# EAGLE design ThoraxSensor3.0 (EAGLE 9.6.2)
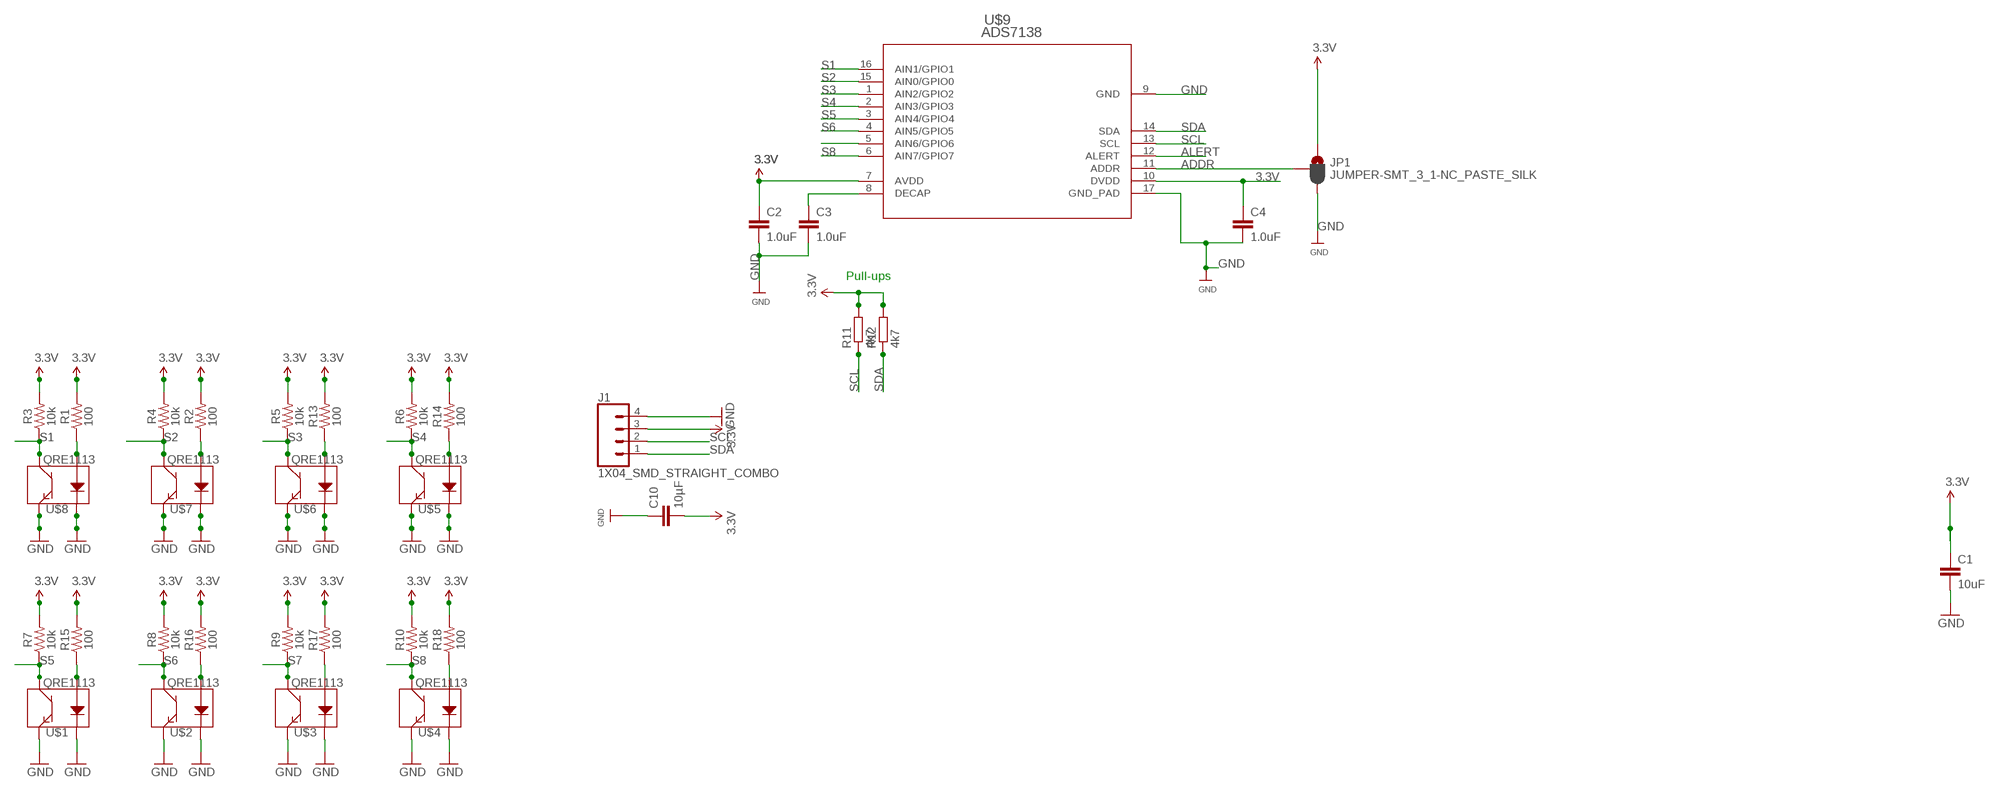
[diagram p0: schematic, sheet 1]

## Parts
C1  10uF  10UF-0805-10V-10%  [0805]
C2  1.0uF  1.0UF-0603-16V-10%  [0603]
C3  1.0uF  1.0UF-0603-16V-10%  [0603]
C4  1.0uF  1.0UF-0603-16V-10%  [0603]
C10  10µF  C-EUC0805  [C0805]
J1  1X04_SMD_STRAIGHT_COMBO  CONN_04SMD_STRAIGHT_COMBO  [1X04_SMD_VERTICAL_COMBO]
JP1  JUMPER-SMT_3_1-NC_PASTE_SILK  [SMT-JUMPER_3_1-NC_PASTE_SILK]
R1  100  100OHM-0603-1/4W-5%  [0603]
R2  100  100OHM-0603-1/4W-5%  [0603]
R3  10k  10KOHM-0603-1/10W-1%  [0603]
R4  10k  10KOHM-0603-1/10W-1%  [0603]
R5  10k  10KOHM-0603-1/10W-1%  [0603]
R6  10k  10KOHM-0603-1/10W-1%  [0603]
R7  10k  10KOHM-0603-1/10W-1%  [0603]
R8  10k  10KOHM-0603-1/10W-1%  [0603]
R9  10k  10KOHM-0603-1/10W-1%  [0603]
R10  10k  10KOHM-0603-1/10W-1%  [0603]
R11  4k7  R-EU_R0603  [R0603]
R12  4k7  R-EU_R0603  [R0603]
R13  100  100OHM-0603-1/4W-5%  [0603]
R14  100  100OHM-0603-1/4W-5%  [0603]
R15  100  100OHM-0603-1/4W-5%  [0603]
R16  100  100OHM-0603-1/4W-5%  [0603]
R17  100  100OHM-0603-1/4W-5%  [0603]
R18  100  100OHM-0603-1/4W-5%  [0603]
U$1  QRE1113  [QRE1113]
U$2  QRE1113  [QRE1113]
U$3  QRE1113  [QRE1113]
U$4  QRE1113  [QRE1113]
U$5  QRE1113  [QRE1113]
U$6  QRE1113  [QRE1113]
U$7  QRE1113  [QRE1113]
U$8  QRE1113  [QRE1113]
U$9  ADS7138  [QFN_8IRTER_TEX]

## Nets
3.3V [pwr]: C1.1 C2.1 C4.1 C10.2 J1.3 JP1.1 R1.2 R2.2 R3.2 R4.2 R5.2 R6.2 R7.2 R8.2 R9.2 R10.2 R11.2 R12.2 R13.2 R14.2 R15.2 R16.2 R17.2 R18.2 U$9.7(AVDD) U$9.10(DVDD)
ADDR: JP1.2 U$9.11(ADDR)
ALERT: U$9.12(ALERT)
GND [pwr]: C1.2 C2.2 C3.2 C4.2 C10.1 J1.4 JP1.3 U$1.2(K) U$1.4(E) U$2.2(K) U$2.4(E) U$3.2(K) U$3.4(E) U$4.2(K) U$4.4(E) U$5.2(K) U$5.4(E) U$6.2(K) U$6.4(E) U$7.2(K) U$7.4(E) U$8.2(K) U$8.4(E) U$9.9(GND) U$9.17(GND_PAD)
N$1: R1.1 U$8.1(A)
N$2: R2.1 U$7.1(A)
N$3: R13.1 U$6.1(A)
N$4: R14.1 U$5.1(A)
N$5: R15.1 U$1.1(A)
N$6: R16.1 U$2.1(A)
N$7: R17.1 U$3.1(A)
N$8: R18.1 U$4.1(A)
N$13: C3.1 U$9.8(DECAP)
S1: R3.1 U$8.3(C) U$9.16(AIN1/GPIO1)
S2: R4.1 U$7.3(C) U$9.15(AIN0/GPIO0)
S3: R5.1 U$6.3(C) U$9.1(AIN2/GPIO2)
S4: R6.1 U$5.3(C) U$9.2(AIN3/GPIO3)
S5: R7.1 U$1.3(C) U$9.3(AIN4/GPIO4)
S6: R8.1 U$2.3(C) U$9.4(AIN5/GPIO5)
S7: R9.1 U$3.3(C) U$9.5(AIN6/GPIO6)
S8: R10.1 U$4.3(C) U$9.6(AIN7/GPIO7)
SCL: J1.2 R11.1 U$9.13(SCL)
SDA: J1.1 R12.1 U$9.14(SDA)

## Notes on the sheet
- Pull-ups

## Library data of the parts
C1 = SparkFun-Capacitors:10UF: 10.0µF ceramic capacitors A capacitor is a passive two-terminal electrical component used to store electrical energy temporarily in an electric field.; PROD_ID: CAP-11330
C2-C4 = SparkFun-Capacitors:1.0UF: 1µF ceramic capacitors A capacitor is a passive two-terminal electrical component used to store electrical energy temporarily in an electric field.; PROD_ID: CAP-00868
C10 = rcl:C-EU: CAPACITOR, European symbol; SPICEPREFIX: C
J1 = SparkFun-Connectors:CONN_04: Multi connection point. Often used as Generic Header-pin footprint for 0.1 inch spaced/style header connections On any of the 0.1 inch spaced packages, you can populate with these: Break Away Headers - Straight <https://www.sparkfun.com/products/116> (PRT-00116) Break Away Male Headers - Right Angle <https://www.sparkfun.com/products/553> (PRT-00553) Female Headers <https://www.sparkfun.com/products/115> (PRT-00115) Break Away Headers - Machine Pin <https://www.sparkfun.com/products/117> (PRT-00117) Break Away Female Headers - Swiss Machine Pin <https://www.sparkfun.com/products/743> (PRT-00743) For SCREWTERMINALS and SPRING TERMINALS visit here: Screw Terimnals on SparkFun.com <https://www.sparkfun.com/search/results?term=Screw+Terminals> (5mm/3.5mm/2.54mm spacing) This device is also useful as a general connection point to wire up your design to another part of your project. Our various solder wires solder well into these plated through hole pads. Hook-Up Wire - Assortment (Stranded, 22 AWG) <https://www.sparkfun.com/products/11375> (PRT-11375) Hook-Up Wire - Assortment (Solid Core, 22 AWG) <https://www.sparkfun.com/products/11367> (PRT-11367) View the entire wire category on our website here <https://www.sparkfun.com/categories/141> Special notes: Molex polarized connector foot print use with SKU : PRT-08231 with associated crimp pins and housings. 1MM SMD Version SKU: PRT-10208; PROD_ID: CONN-08511
JP1 = SparkFun-Jumpers:JUMPER-SMT_3_1-NC_PASTE: Normally closed solder jumper (1 of 2 connections) This jumper has an aperture in the stencil to allow solder paste to bridge one of the two connections. One connection is normally closed (NC), while the other is normally open (NO). Wick off the solder to open the connection. Reapply solder to reclose the connection. Apply solder to the other side instead to change the current path.
R1 R2 R13-R18 = SparkFun-Resistors:100OHM: 100Ω resistor A resistor is a passive two-terminal electrical component that implements electrical resistance as a circuit element. Resistors act to reduce current flow, and, at the same time, act to lower voltage levels within circuits. - Wikipedia; PROD_ID: RES-12438
R3-R10 = SparkFun-Resistors:10KOHM: 10kΩ resistor A resistor is a passive two-terminal electrical component that implements electrical resistance as a circuit element. Resistors act to reduce current flow, and, at the same time, act to lower voltage levels within circuits. - Wikipedia; PROD_ID: RES-00824
R11 R12 = rcl:R-EU_: RESISTOR, European symbol; SPICEPREFIX: R
U$1-U$8 = SparkFun:QRE1113
U$9 = ADS7138:ADS7138

## Net classes
1 pwr: width 0.254 mm

## Board
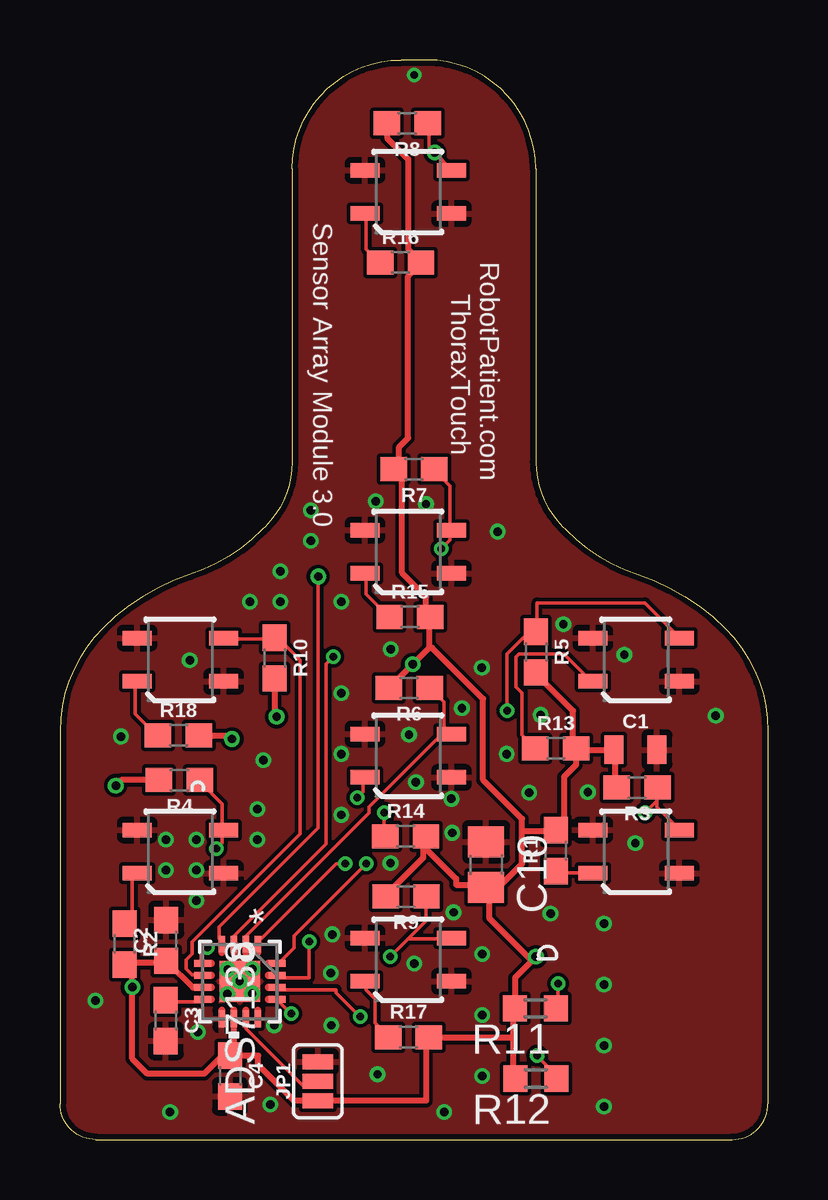
[diagram p1: board, top side]
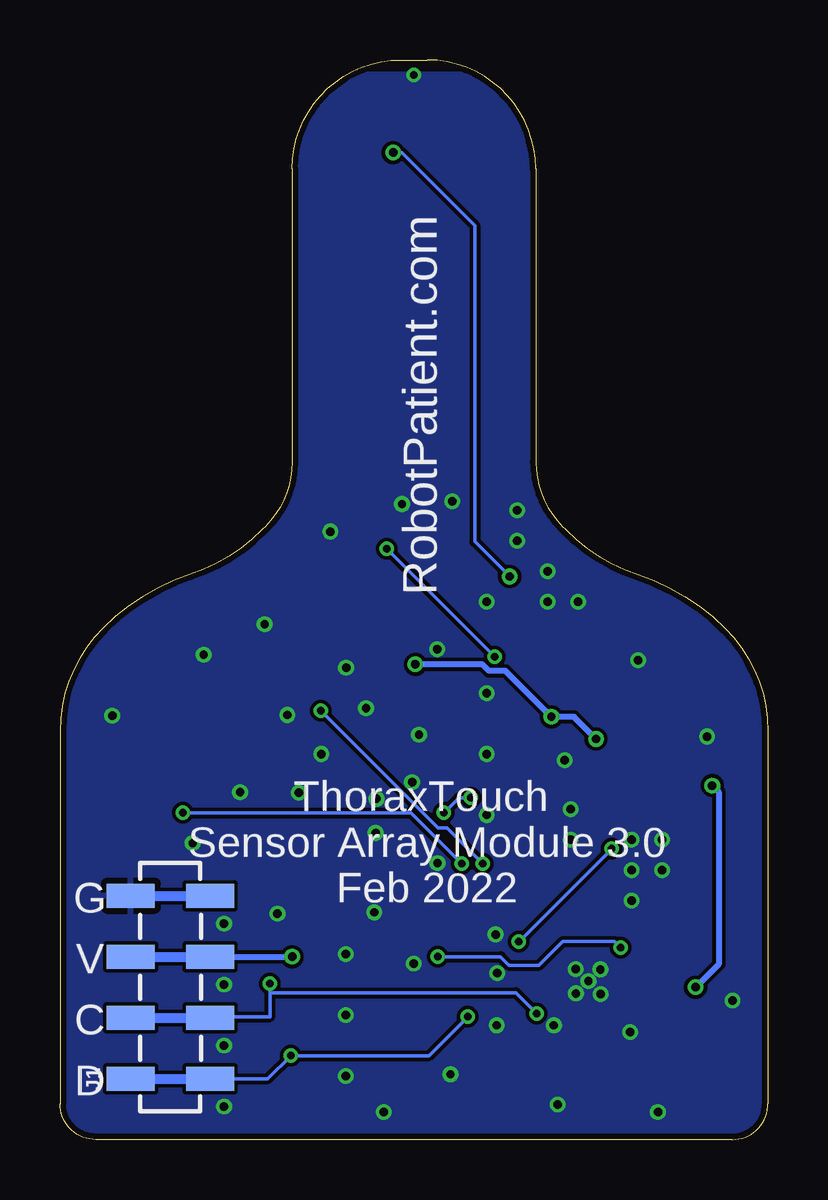
[diagram p2: board, bottom side, seen from below]

Size 29.52 x 45 mm. Coordinates in mm from the lower left corner, seen from the top.
Outline: 9.68,40.46 arc-90 14.22,45 15.3,45 arc-90 19.84,40.46 19.84,28.25 arc45 20.96,25.55 21.09,25.42 arc27 24.11,23.55 arc-27 27.74,21.31 arc-45 29.52,17.01 29.52,1.5 arc-90 28.02,0 1.5,0 arc-90 0,1.5 0,17.01 arc-45 1.78,21.31 arc-27 5.41,23.55 arc27 8.43,25.42 8.56,25.55 arc45 9.68,28.25 9.68,40.46
Copper layers (1*16): Top 0.035mm / dielectric 1.5mm / Bottom 0.035mm
Design rules "ITEADstudio_DRC-2": minimum track width 6mil, minimum drill 12mil, track to track 6mil, track to pad 6mil, pad to pad 6mil, via to via 6mil, smd to smd 0mil, copper to edge 10mil, drill to drill 10mil, minimum pad ring 10mil, minimum via ring 6mil, stop-mask expansion 2mil, vias tented up to drill 100mil, thermal gap 10mil

### Footprints (pad centres in the part's own frame; a part is rotated, then mirrored left to right if it is on the bottom)
0805 = smd 0.8 x 1.2: 1 -0.9,0; 2 0.9,0
0603 = smd 1.1 x 1: 1 -0.85,0; 2 0.85,0
C0805 = smd 1.3 x 1.5: 1 -0.95,0; 2 0.95,0
1X04_SMD_VERTICAL_COMBO = smd 1 x 2: 1 0,-1.65; 1-2 0,1.65; 2 2.54,1.65; 2-2 2.54,-1.65; 3 5.08,-1.65; 3-2 5.08,1.65; 4 7.62,1.65; 4-2 7.62,-1.65
SMT-JUMPER_3_1-NC_PASTE_SILK = smd 0.635 x 1.27: 1 -0.813,0; 2 0,0; 3 0.813,0
R0603 = smd 1 x 1.1: 1 -0.85,0; 2 0.85,0
QRE1113 = smd 1.2 x 0.6: 1 -1.8,-0.9; 2 1.8,-0.9; 3 1.8,0.9; 4 -1.8,0.9
QFN_8IRTER_TEX = smd 0.7 x 0.28: 1 -1.558,0.75; 2 -1.558,0.25; 3 -1.558,-0.25; 4 -1.558,-0.75; 9 1.558,-0.75; 10 1.558,-0.25; 11 1.558,0.25; 12 1.558,0.75 | smd 0.28 x 0.7: 5 -0.75,-1.558; 6 -0.25,-1.558; 7 0.25,-1.558; 8 0.75,-1.558; 13 0.75,1.558; 14 0.25,1.558; 15 -0.25,1.558; 16 -0.75,1.558 | smd 1.7 x 1.7: 17 0,0

### Placement (x,y rotation side)
C1  23.99,16.25 0 top
C2  4.43,8.3 90 top
C3  4.41,4.96 270 top
C4  7.09,2.65 270 top
C10  17.77,11.46 270 top
J1  24.92,2.54 90 bottom
JP1  10.75,2.43 90 top
R1  20.68,12.04 90 top
R2  2.69,8.15 270 top
R3  24.06,14.67 180 top
R4  4.98,14.98 180 top
R5  19.84,20.32 270 top
R6  14.56,18.83 180 top
R7  14.76,27.94 180 top
R8  14.48,42.36 180 top
R9  14.43,10.14 180 top
R10  8.95,20.07 270 top
R11  19.82,5.47 180 top
R12  19.84,2.54 180 top
R13  20.67,16.3 0 top
R14  14.41,12.64 0 top
R15  14.59,21.78 0 top
R16  14.2,36.56 0 top
R17  14.53,4.27 0 top
R18  4.94,16.84 0 top
U$1  14.52,24.5 0 top
U$2  14.52,39.5 0 top
U$3  14.52,7.5 0 top
U$4  5.02,20 0 top
U$5  14.52,16 0 top
U$6  24.02,20 0 top
U$7  5.02,12 0 top
U$8  24.02,12 0 top
U$9  7.5,6.59 270 top

### Tracks (layer width: path | path; a pad name or v marks a point on that pad's centre or on a via)
3.3V  (via drill 0.35)
  Top 0.254: 5.77,16.62 5.77,16.75 R18.2 | 5.89,17 5.89,16.88 R18.2 | 8.89,19.12 R10.2 8.95,17.7 v9.03,17.62 | 4.39,7.38 2.77,7.38 R2.2 | 4.39,7.38 C2.1 | 7.14,3.5 8.27,3.5 8.27,3.12 9.77,1.62 10.64,1.62 JP1.1 10.77,1.62 15.27,1.62 15.27,4.25 R17.2 15.39,4.25 18.89,4.25 | 7.14,3.5 C4.1 6.77,3.5 6.02,2.75 3.65,2.75 3.02,3.38 v3.02,6.35 3.02,7.25 R2.2 | 4.02,14.88 R4.2 2.56,14.98 v2.33,14.75 | 2.9,6.88 R2.2 | R8.2 13.64,42.25 13.64,41.75 14.52,40.88 14.52,37.12 15.02,36.62 R16.2 15.02,36.5 14.52,36 14.52,29.25 14.14,28.88 14.14,27.88 R7.2 14.02,27.88 14.27,27.62 14.27,23.62 15.27,22.62 15.27,21.75 R15.2 15.39,21.75 15.39,20.5 | R6.2 13.77,18.88 v14.7,19.8 | R3.2 23.14,14.75 23.14,16.25 C1.1 21.64,16.25 R13.2 | R13.2 21.52,15.62 21.02,15.12 21.02,13.25 20.77,13 R1.2 20.64,12.88 19.27,12.88 | R5.2 19.89,19.38 21.39,17.88 21.39,16.25 R13.2 | 18.89,4.25 18.89,5.38 R11.2 18.97,6.75 v19.84,7.62 19.64,7.5 17.89,9.25 17.89,10.5 C10.2 | 18.89,4.25 18.89,2.62 R12.2 | 15.14,12.12 15.14,12.62 R14.2 | 15.14,12.12 15.14,11.75 13.64,10.25 R9.2 | C10.2 17.77,10.62 16.52,10.62 16.52,10.88 15.27,12.12 15.14,12.12 | 19.27,12.88 19.27,11.5 18.02,10.25 C10.2 | 19.27,12.88 19.27,13.38 17.64,15 17.64,18.38 15.52,20.5 15.39,20.5 | U$9.7 5.55,6.34 4.52,7.38 4.39,7.38 | U$9.10 7.25,3.61 7.14,3.5 | R18.2 7.03,16.84 v7.17,16.7 | v14.7,19.8 15.39,20.5 | v14.7,19.81 14.68,19.81 v14.7,19.8
  Bottom 0.254: J1.3 v19.84,7.62 | v14.7,19.81 11.91,19.81 11.64,19.54 10.95,19.54 v9.03,17.62 8.09,17.62 v7.17,16.7 | v2.33,14.75 2.06,14.49 2.06,7.31 v3.02,6.35
ADDR
  Top 0.152: U$9.11 7.77,5 7.77,4.62 10.14,2.25 10.64,2.25 10.64,2.38 JP1.2
GND  (via drill 0.3, 0.35)
  other vias: 14.77,44.38 6.99,7.09 8.02,7.11 6.98,6.06 8.01,6.09 7.49,6.6 5.75,4.48 8.93,4.76 8.77,1.46 11.31,4.76 11.29,6.94 11.36,8.55 14.77,7.33 16.41,9.47 13.78,11.52 16.36,12.78 14.84,14.9 14.55,16.87 16.76,17.98 16.32,14.2 18.62,16.07 20.04,17.7 17.59,19.67 13.79,20.44 8.48,15.81 2.54,16.8 5.41,19.98 4.42,12.5 1.48,5.79 4.42,11.23 5.69,11.23 5.69,12.5 8.23,12.5 5.69,9.96 8.23,13.77 11.73,13.53 11.73,16.07 11.73,18.61 11.73,22.42 7.92,22.42 9.19,23.69 9.19,22.42 10.46,24.96 10.46,26.23 15.26,26.49 13.17,26.61 18.25,25.34 20.99,21.48 23.53,20.21 27.34,17.67 19.56,14.46 22.01,14.48 23.99,12.36 20.45,9.42 17.6,7.73 17.6,5.19 17.6,2.65 22.68,3.92 22.68,6.46 22.68,9 22.68,1.38 13.24,2.72 16.02,1.15 4.59,1.15
  pour Top: -3.02,45.72 37.62,45.72 37.62,-5.08 -5.56,-5.08 -5.56,45.72
  pour Bottom: -0.48,44.45 40.16,44.45 40.16,-6.35 -3.02,-6.35 -3.02,44.45
N$1
  Top 0.152: R1.1 20.77,11.12 22.14,11.12 U$8.1
N$2
  Top 0.152: R2.1 2.77,9 3.02,9.25 3.02,11 3.15,11.12 U$7.1
N$3
  Top 0.152: R13.1 19.77,16.38 19.27,16.88 19.27,18.62 19.02,18.88 19.02,20.12 19.14,20.25 21.02,20.25 22.14,19.12 U$6.1
N$4  (via drill 0.3)
  Top 0.152: v13.52,13.62 13.52,12.75 R14.1 | v12.39,14.25 12.64,14.5 12.64,15 U$5.1
  Bottom 0.152: v13.52,13.62 12.89,14.25 v12.39,14.25
N$5
  Top 0.152: R15.1 12.77,22.75 12.77,23.5 U$1.1
N$6
  Top 0.152: R16.1 13.27,36.62 12.77,37.12 12.77,38.5 U$2.1
N$7
  Top 0.152: R17.1 13.64,4.38 13.14,4.88 13.14,5.88 12.77,6.25 12.77,6.5 U$3.1
N$8
  Top 0.152: R18.1 4.02,16.88 3.15,17.75 3.15,19 U$4.1
N$13
  Top 0.152: U$9.8 5.89,5.75 4.52,5.75 C3.1
S1  (via drill 0.3)
  Top 0.152: v12.77,11.5 9.77,8.5 9.77,8 9.14,7.38 U$9.16 | 24.89,14.12 v24.39,13.62 | 24.89,14.12 24.89,14.62 R3.1 | 24.89,14.12 24.89,13.88 25.77,13 U$8.3
  Bottom 0.152: v12.77,11.5 14.89,13.62 v24.39,13.62
S2  (via drill 0.3)
  Top 0.152: v10.39,8.25 10.39,6.75 9.14,6.75 U$9.15 | v6.52,12.12 6.77,12.38 6.77,12.88 U$7.3 6.77,13 6.77,14 5.89,14.88 R4.1
  Bottom 0.152: v6.52,12.12 v10.39,8.25
S3  (via drill 0.3)
  Top 0.152: v11.89,11.5 11.52,11.5 8.27,8.25 U$9.1 | v18.64,17.88 18.64,20.25 19.52,21.12 19.77,21.12 R5.1 19.89,21.25 19.89,22.38 24.39,22.38 25.77,21 U$6.3
  Bottom 0.152: v11.89,11.5 13.39,13 13.77,13 v18.64,17.88
S4
  Top 0.152: 16.02,16.88 16.27,16.88 U$5.3 16.02,16.88 | 16.02,16.88 15.89,16.88 12.89,13.88 12.89,13.62 7.77,8.5 7.77,8.25 U$9.2 | 16.02,16.88 16.02,18.25 15.52,18.75 R6.1
S5  (via drill 0.3)
  Top 0.152: v11.39,20.12 11.09,19.82 11.09,12.32 7.27,8.5 7.27,8.25 U$9.3 | v15.89,24.62 16.27,25 16.27,25.38 U$1.3 16.27,25.5 16.27,27.25 15.64,27.88 R7.1
  Bottom 0.152: v15.89,24.62 v11.39,20.12
S6  (via drill 0.35)
  Top 0.152: v10.77,23.47 10.77,13 6.64,8.88 6.64,8.38 6.77,8.25 U$9.4 | 15.27,42.38 R8.1 15.39,42.25 15.39,41.38 v15.63,41.14 16.27,40.5 U$2.3
  Bottom 0.152: v15.63,41.14 15.26,41.14 12.22,38.1 12.22,24.92 v10.77,23.47
S7  (via drill 0.3)
  Top 0.152: v6.14,8 5.89,7.75 5.89,7.38 U$9.5 | 14.52,8.38 15.27,9.12 15.27,10.12 R9.1 | 14.52,8.38 v13.77,7.62 | 14.52,8.38 16.27,8.38 U$3.3
  Bottom 0.152: v13.77,7.62 11.15,7.62 10.8,7.27 9.55,7.27 8.56,8.26 6.4,8.26 v6.14,8
S8
  Top 0.152: U$9.6 5.89,6.88 5.52,6.88 5.27,7.12 5.27,7.5 5.52,7.75 5.52,8.25 10.02,12.75 10.02,20 9.02,21 R10.1 8.89,20.88 6.89,20.88 U$4.3
SCL  (via drill 0.3)
  Top 0.152: v9.64,5.25 9.14,5.75 U$9.13 | v20.77,6.5 20.77,5.5 R11.1
  Bottom 0.152: v9.64,5.25 10.52,6.12 20.77,6.12 | J1.2 26.63,5.12 20.77,5.12 20.77,6.12 | 20.77,6.12 v20.77,6.5
SDA  (via drill 0.3)
  Top 0.152: v12.52,5.12 11.52,6.12 11.52,6.25 9.14,6.25 U$9.14 | v19.89,3.5 20.64,2.75 20.64,2.62 R12.1
  Bottom 0.152: v12.52,5.12 14.14,3.5 v19.89,3.5 20.86,2.54 J1.1

### Text on the board
_tsilk: Sensor Array Module 3.0 | RobotPatient.com / ThoraxTouch
_bsilk: RobotPatient.com | ThoraxTouch / Sensor Array Module 3.0 / Feb 2022 | G | V | C | D